# Altium schematic sheet TWO_OUTPORT.SchDoc
size A3
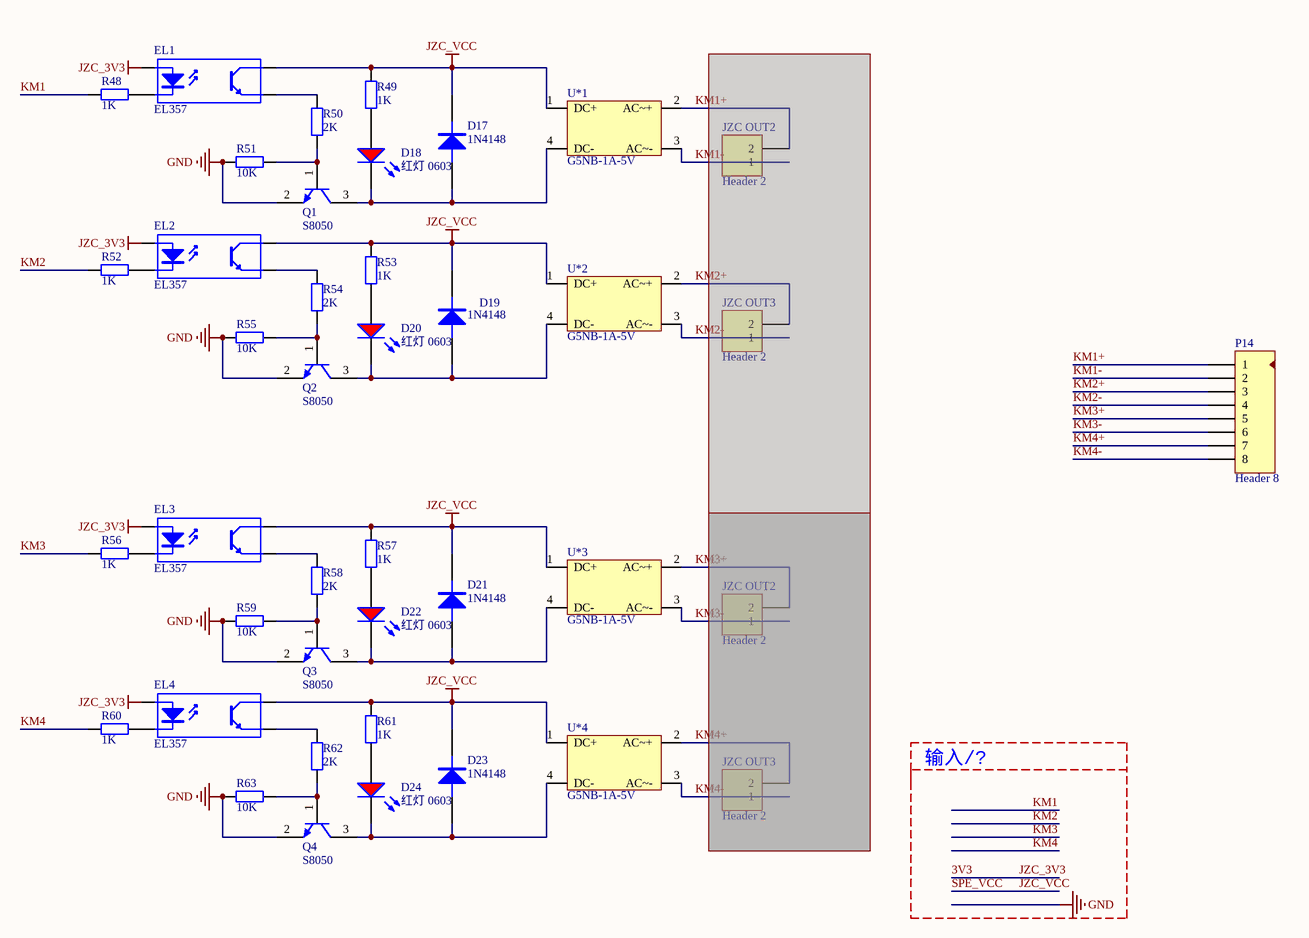
[diagram p0: TWO_OUTPORT.SchDoc]

## Parts
(Parts that share a designator on the sheet are numbered #1, #2 ... from top to bottom, then left to right.)
D17  1N4148  [LC-LL-34]
D18  红灯 0603  [LC-0603_LED_S1]
D19  1N4148  [LC-LL-34]
D20  红灯 0603  [LC-0603_LED_S1]
D21  1N4148  [LC-LL-34]
D22  红灯 0603  [LC-0603_LED_S1]
D23  1N4148  [LC-LL-34]
D24  红灯 0603  [LC-0603_LED_S1]
EL1  EL357  [lc-sop-4_P2.54]
EL2  EL357  [lc-sop-4_P2.54]
EL3  EL357  [lc-sop-4_P2.54]
EL4  EL357  [lc-sop-4_P2.54]
JZC_OUT2#1  Header 2  [D5.08-2P]  (masked out: inside a compile mask, not in the netlist)
JZC_OUT2#2  Header 2  [D5.08-2P]  (masked out: inside a compile mask, not in the netlist)
JZC_OUT3#1  Header 2  [D5.08-2P]  (masked out: inside a compile mask, not in the netlist)
JZC_OUT3#2  Header 2  [D5.08-2P]  (masked out: inside a compile mask, not in the netlist)
P14  Header 8  [5.08-8p]
Q1  S8050  [LC-SOT-23(SOT-23-3)]
Q2  S8050  [LC-SOT-23(SOT-23-3)]
Q3  S8050  [LC-SOT-23(SOT-23-3)]
Q4  S8050  [LC-SOT-23(SOT-23-3)]
R48  1K  [LC-0603_R]
R49  1K  [LC-0603_R]
R50  2K  [LC-0603_R]
R51  10K  [LC-0603_R]
R52  1K  [LC-0603_R]
R53  1K  [LC-0603_R]
R54  2K  [LC-0603_R]
R55  10K  [LC-0603_R]
R56  1K  [LC-0603_R]
R57  1K  [LC-0603_R]
R58  2K  [LC-0603_R]
R59  10K  [LC-0603_R]
R60  1K  [LC-0603_R]
R61  1K  [LC-0603_R]
R62  2K  [LC-0603_R]
R63  10K  [LC-0603_R]
U*1  G5NB-1A-5V  [G5NB-1A-5V]
U*2  G5NB-1A-5V  [G5NB-1A-5V]
U*3  G5NB-1A-5V  [G5NB-1A-5V]
U*4  G5NB-1A-5V  [G5NB-1A-5V]

## Nets
3V3: EL1.1(A) EL2.1(A) EL3.1(A) EL4.1(A)  [also labelled JZC_3V3]
GND: Q1.2(E) Q2.2(E) Q3.2(E) Q4.2(E) R51.2 R55.2 R59.2 R63.2
JZC_VCC: D17.2(K) D19.2(K) D21.2(K) D23.2(K) EL1.4(C) EL2.4(C) EL3.4(C) EL4.4(C) R49.1 R53.1 R57.1 R61.1 U*1.1(DC+) U*2.1(DC+) U*3.1(DC+) U*4.1(DC+)  [also labelled SPE_VCC]
KM1: R48.2
KM1+: P14.1 U*1.2(AC~+)
KM1-: P14.2 U*1.3(AC~-)
KM2: R52.2
KM2+: P14.3 U*2.2(AC~+)
KM2-: P14.4 U*2.3(AC~-)
KM3: R56.2
KM3+: P14.5 U*3.2(AC~+)
KM3-: P14.6 U*3.3(AC~-)
KM4: R60.2
KM4+: P14.7 U*4.2(AC~+)
KM4-: P14.8 U*4.3(AC~-)
NetD17_1: D17.1(A) D18.K Q1.3(C) U*1.4(DC-)
NetD18_A: D18.A R49.2
NetD19_1: D19.1(A) D20.K Q2.3(C) U*2.4(DC-)
NetD20_A: D20.A R53.2
NetD21_1: D21.1(A) D22.K Q3.3(C) U*3.4(DC-)
NetD22_A: D22.A R57.2
NetD23_1: D23.1(A) D24.K Q4.3(C) U*4.4(DC-)
NetD24_A: D24.A R61.2
NetEL1_2: EL1.2(K) R48.1
NetEL1_3: EL1.3(E) R50.2
NetEL2_2: EL2.2(K) R52.1
NetEL2_3: EL2.3(E) R54.2
NetEL3_2: EL3.2(K) R56.1
NetEL3_3: EL3.3(E) R58.2
NetEL4_2: EL4.2(K) R60.1
NetEL4_3: EL4.3(E) R62.2
NetQ1_1: Q1.1(B) R50.1 R51.1
NetQ2_1: Q2.1(B) R54.1 R55.1
NetQ3_1: Q3.1(B) R58.1 R59.1
NetQ4_1: Q4.1(B) R62.1 R63.1

## Notes on the sheet
- 输入/?

## Library data of the parts
D17 D19 D21 D23 = DIODE
D18 D20 D22 D24 = 0: 发光二极管; ComponentLink1Description: 供应商链接; ComponentLink1URL: http://www.szlcsc.com/product/details_2659.html; Package: 0603; Supplier: LC; SuppliersPartNumber: C2286
EL1-EL4 = ST188: 反射式光电传感器; Published: 24-Mar-1999; LatestRevisionDate: 04-Mar-2005; LatestRevisionNote: Sch pins 3 & 4 Swapped.; DatasheetDocument: Nov-2003; PackageReference: DIP-4; Publisher: Altium Limited
JZC_OUT2#1 JZC_OUT2#2 JZC_OUT3#1 JZC_OUT3#2 = Header 2: Header, 2-Pin; LatestRevisionDate: 17-Jul-2002; LatestRevisionNote: Re-released for DXP Platform.; Publisher: Altium Limited
P14 = Header: 接插件; LatestRevisionDate: 17-Jul-2002; LatestRevisionNote: Re-released for DXP Platform.; Publisher: Altium Limited
R48-R63 = Res2: Resistor; Published: 8-Jun-2000; LatestRevisionDate: 17-Jul-2002; LatestRevisionNote: Re-released for DXP Platform.; PackageReference: AXIAL-0.4; Publisher: Altium Limited
  R48 R49 R52 R53 R56 R57 R60 R61: Value: 1K
  R50 R54 R58 R62: Value: 2K
  R51 R55 R59 R63: Value: 10K